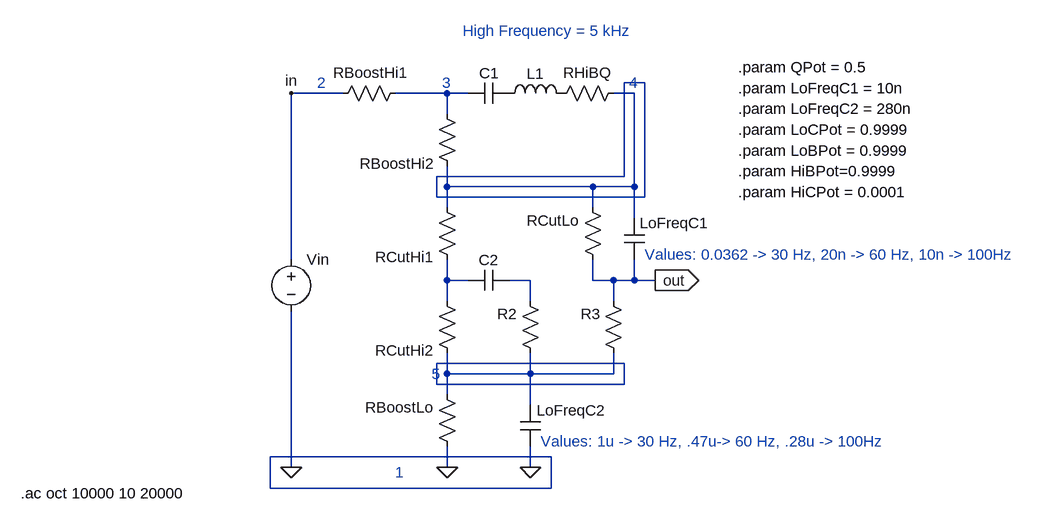
[diagram p0: schematic EQP1_orig_woInputR_nodeAnalysis.asc]
EQP1_orig_woInputR_nodeAnalysis.asc, the LTspice schematic file:
Version 4
SHEET 1 1112 1412
WIRE -160 -80 -192 -80
WIRE -624 -64 -704 -64
WIRE -464 -64 -544 -64
WIRE -432 -64 -464 -64
WIRE -176 -64 -208 -64
WIRE -464 -32 -464 -64
WIRE -192 64 -192 -80
WIRE -192 64 -480 64
WIRE -464 80 -464 48
WIRE -240 80 -464 80
WIRE -176 80 -176 -64
WIRE -176 80 -240 80
WIRE -480 96 -480 64
WIRE -160 96 -160 -80
WIRE -160 96 -480 96
WIRE -464 112 -464 80
WIRE -240 112 -240 80
WIRE -176 128 -176 80
WIRE -704 192 -704 -64
WIRE -464 224 -464 192
WIRE -432 224 -464 224
WIRE -336 224 -368 224
WIRE -240 224 -240 192
WIRE -208 224 -240 224
WIRE -176 224 -176 192
WIRE -176 224 -208 224
WIRE -144 224 -176 224
WIRE -464 256 -464 224
WIRE -336 256 -336 224
WIRE -208 256 -208 224
WIRE -192 352 -480 352
WIRE -464 368 -464 336
WIRE -336 368 -336 336
WIRE -336 368 -464 368
WIRE -208 368 -208 336
WIRE -208 368 -336 368
WIRE -480 384 -480 352
WIRE -192 384 -192 352
WIRE -192 384 -480 384
WIRE -464 400 -464 368
WIRE -336 416 -336 368
WIRE -304 496 -736 496
WIRE -704 512 -704 272
WIRE -464 512 -464 480
WIRE -336 512 -336 480
WIRE -736 544 -736 496
WIRE -304 544 -304 496
WIRE -304 544 -736 544
FLAG -704 512 0
FLAG -464 512 0
FLAG -336 512 0
FLAG -144 224 out
IOPIN -144 224 Out
FLAG -704 -64 in
SYMBOL cap -432 -48 R270
WINDOW 0 47 17 VRight 2
WINDOW 3 0 32 Invisible 2
SYMATTR InstName C1
SYMATTR Value 10n
SYMBOL ind -384 -48 R270
WINDOW 0 46 42 VRight 2
WINDOW 3 1 57 Invisible 2
SYMATTR InstName L1
SYMATTR Value 100m
SYMBOL cap -192 128 R0
WINDOW 3 24 56 Invisible 2
SYMATTR Value {LoFreqC1}
SYMATTR InstName LoFreqC1
SYMBOL voltage -704 176 R0
WINDOW 3 24 96 Invisible 2
SYMATTR Value ""
SYMATTR Value2 AC 1
SYMATTR InstName Vin
SYMBOL res -528 -80 R90
WINDOW 0 0 54 VBottom 2
WINDOW 3 -10 54 Invisible 2
SYMATTR InstName RBoostHi1
SYMATTR Value {(1-HiBPot)*10k}
SYMBOL res -448 64 R180
WINDOW 0 36 20 Left 2
WINDOW 3 36 48 Invisible 2
SYMATTR InstName RBoostHi2
SYMATTR Value {HiBPot*10k}
SYMBOL res -192 -80 R90
WINDOW 0 0 56 VBottom 2
WINDOW 3 32 56 Invisible 2
SYMATTR InstName RHiBQ
SYMATTR Value {QPot*2k5}
SYMBOL res -224 208 R180
WINDOW 0 36 76 Left 2
WINDOW 3 36 40 Invisible 2
SYMATTR InstName RCutLo
SYMATTR Value {LoCPot*100k}
SYMBOL res -448 208 R180
WINDOW 0 36 20 Left 2
WINDOW 3 36 48 Invisible 2
SYMATTR InstName RCutHi1
SYMATTR Value {(1-HiCPot)*1k}
SYMBOL cap -368 208 R90
WINDOW 0 0 32 VBottom 2
WINDOW 3 32 32 Invisible 2
SYMATTR InstName C2
SYMATTR Value 130n
SYMBOL res -320 352 R180
WINDOW 0 36 76 Left 2
WINDOW 3 36 40 Invisible 2
SYMATTR InstName R2
SYMATTR Value 820
SYMBOL res -448 352 R180
WINDOW 0 36 20 Left 2
WINDOW 3 36 48 Invisible 2
SYMATTR InstName RCutHi2
SYMATTR Value {HiCPot*1k}
SYMBOL res -192 352 R180
WINDOW 0 36 76 Left 2
WINDOW 3 36 40 Invisible 2
SYMATTR InstName R3
SYMATTR Value 12k
SYMBOL res -448 496 R180
WINDOW 0 36 76 Left 2
WINDOW 3 36 40 Invisible 2
SYMATTR InstName RBoostLo
SYMATTR Value {LoBPot*10k}
SYMBOL cap -352 416 R0
WINDOW 0 26 8 Left 2
WINDOW 3 24 56 Invisible 2
SYMATTR InstName LoFreqC2
SYMATTR Value {LoFreqC2}
TEXT -160 184 Left 2 ;Values: 0.0362 -> 30 Hz, 20n -> 60 Hz, 10n -> 100Hz
TEXT -320 472 Left 2 ;Values: 1u -> 30 Hz, .47u-> 60 Hz, .28u -> 100Hz
TEXT -544 520 Left 2 ;1
TEXT -664 -80 Left 2 ;2
TEXT -472 -80 Left 2 ;3
TEXT -184 -80 Left 2 ;4
TEXT -488 368 Left 2 ;5
TEXT -16 -72 Left 2 !.param LoFreqC1 = 10n
TEXT -16 -104 Left 2 !.param QPot = 0.5
TEXT -16 -40 Left 2 !.param LoFreqC2 = 280n
TEXT -16 -8 Left 2 !.param LoCPot = 0.9999
TEXT -16 56 Left 2 !.param HiBPot=0.9999
TEXT -16 88 Left 2 !.param HiCPot = 0.0001
TEXT -1120 552 Left 2 !.ac oct 10000 10 20000
TEXT -16 24 Left 2 !.param LoBPot = 0.9999
TEXT -440 -160 Left 2 ;High Frequency = 5 kHz

The netlist it stands for:
* EQP1_orig_woInputR_nodeAnalysis.asc
C1 N002 P001 10n
L1 P001 P002 100m
C§LoFreqC1 N003 out {LoFreqC1}
Vin in 0 AC 1
RBoostHi1 N002 in {(1-HiBPot)*10k}
RBoostHi2 N003 N002 {HiBPot*10k}
RHiBQ N003 P002 {QPot*2k5}
RCutLo out N003 {LoCPot*100k}
RCutHi1 N004 N003 {(1-HiCPot)*1k}
C2 N005 N004 130n
R2 N007 N005 820
RCutHi2 N007 N004 {HiCPot*1k}
R3 N007 out 12k
RBoostLo 0 N007 {LoBPot*10k}
C§LoFreqC2 N007 0 {LoFreqC2}
* Values: 0.0362 -> 30 Hz, 20n -> 60 Hz, 10n -> 100Hz
* Values: 1u -> 30 Hz, .47u-> 60 Hz, .28u -> 100Hz
* 1
* 2
* 3
* 4
* 5
.param LoFreqC1 = 10n
.param QPot = 0.5
.param LoFreqC2 = 280n
.param LoCPot = 0.9999
.param HiBPot=0.9999
.param HiCPot = 0.0001
.ac oct 10000 10 20000
.param LoBPot = 0.9999
* High Frequency = 5 kHz
.backanno
.end